# Altium schematic sheet RS_IF.SchDoc
size 420 x 297 mm; SheetNumber: 6; PageSetup: Record=PageOptions|CenterHorizontal=False|CenterVertical=False|PrintScale=0.95|XCorrection=0.00|YCorrection=0.00|PrintKind=1|BorderSize=5000000|LeftOffset=0|BottomOffset=0|Orientation=1|PaperLength=1000|PaperWidth=1000|Scale=100|PaperSource=15|PrintQuality=600|MediaType=1|DitherType=10|PaperKind=A4|PrintScaleMode=1
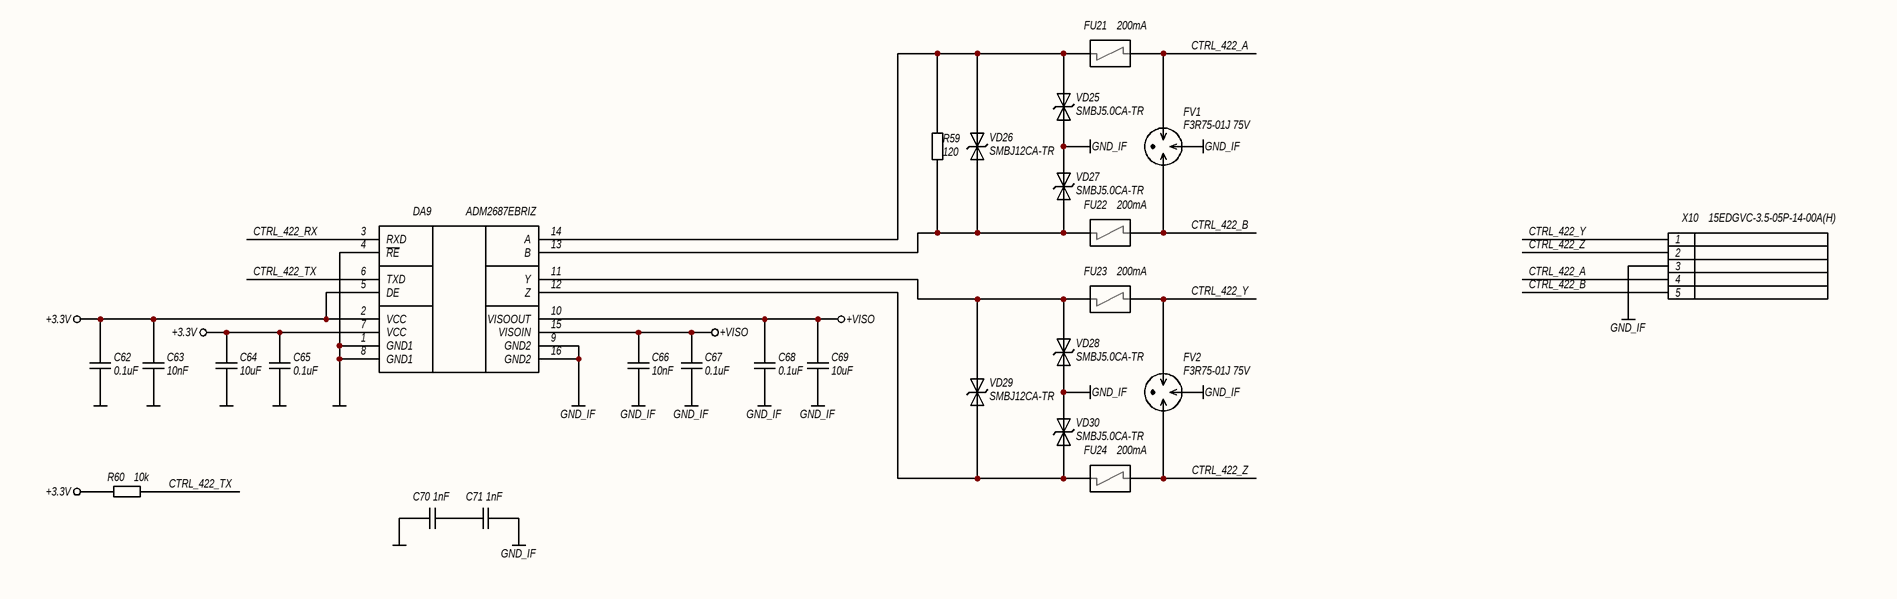
[diagram p0: RS_IF.SchDoc]

## Parts
C62  0.1uF  [C0603N]
C63  10nF  [C0603N]
C64  10uF  [C0805N]
C65  0.1uF  [C0603N]
C66  10nF  [C0603N]
C67  0.1uF  [C0603N]
C68  0.1uF  [C0603N]
C69  10uF  [C0805N]
C70  1nF  [C1808N]
C71  1nF  [C1808N]
DA9  ADM2687EBRIZ  [SOIC16_IC]
FU21  200mA  [TBU-CA]
FU22  200mA  [TBU-CA]
FU23  200mA  [TBU-CA]
FU24  200mA  [TBU-CA]
FV1  F3R75-01J 75V  [GDT_3PIN_B2]
FV2  F3R75-01J 75V  [GDT_3PIN_B2]
R59  120  [R0805N]
R60  10k  [R0603N]
VD25  SMBJ5.0CA-TR  [SMB]
VD26  SMBJ12CA-TR  [SMB]
VD27  SMBJ5.0CA-TR  [SMB]
VD28  SMBJ5.0CA-TR  [SMB]
VD29  SMBJ12CA-TR  [SMB]
VD30  SMBJ5.0CA-TR  [SMB]
X10  15EDGVC-3.5-05P-14-00A(H)  [15EDGVC-3.5-05P-14-00A(H)]

## Nets
+3.3V: C62.2 C63.1 C64.2 C65.2 DA9.2(VCC) DA9.5(DE) DA9.7(VCC) R60.2
+VISO: C66.1 C67.2 C68.2 C69.2 DA9.10(VISOOUT) DA9.15(VISOIN)
GND: C62.1 C63.2 C64.1 C65.1 C70.2 DA9.1(GND1) DA9.4(~{RE}) DA9.8(GND1)
GND_IF: C66.2 C67.1 C68.1 C69.1 C71.1 DA9.9(GND2) DA9.16(GND2) FV1.2 FV2.2 VD25.2(A2) VD27.2(A2) VD28.2(A2) VD30.2(A2) X10.3
CTRL_422_A: FU21.3(IN/OUT) FV1.1 X10.4
CTRL_422_B: FU22.3(IN/OUT) FV1.3 X10.5
CTRL_422_RX: DA9.3(RXD)
CTRL_422_TX: DA9.6(TXD) R60.1
CTRL_422_Y: FU23.3(IN/OUT) FV2.1 X10.1
CTRL_422_Z: FU24.3(IN/OUT) FV2.3 X10.2
NetC70_1: C70.1 C71.2
NetDA9_11: DA9.11(Y) FU23.1(IN/OUT) VD28.1(A1) VD29.1(A1)
NetDA9_12: DA9.12(Z) FU24.1(IN/OUT) VD29.2(A2) VD30.1(A1)
NetDA9_13: DA9.13(B) FU22.1(IN/OUT) R59.2 VD26.2(A2) VD27.1(A1)
NetDA9_14: DA9.14(A) FU21.1(IN/OUT) R59.1 VD25.1(A1) VD26.1(A1)

## Notes on the sheet
- Подп. и дата
- Инв. № дубл.
- Взам. инв. №
- Инв. № подл.
- Лист
- Изм.
- № докум.
- Подп.
- Дата
- Копировал
- Формат А3

## Library data of the parts
C62 C65 C67 C68 = CL10B104KB8NNNC: Конденсатор; Точность: 10%; Напряжение: 50V; Диэлектрик: X7R; Производитель: Samsung Electro-Mechanics; Описание: 0.1 µF ±10% 50V Ceramic Capacitor X7R 0603 (1608 Metric); Корпус: 0603 (1608 Metric); Температурный диапазон: -55°C ~ 125°C; Вид монтажа: SMD; Артикул: CL10B104KB8NNNC; Номинал: 0.1uF; Строка для документации: https://mm.digikey.com/Volume0/opasdata/d220001/medias/docus/609/CL10B104KB8NNNC_Spec.pdf; Тип элемента: Конденсатор
C63 C66 = CL10B103KB8NNNC: Конденсатор; Точность: 10%; Напряжение: 16V; Диэлектрик: X7R; Производитель: Samsung Electro-Mechanics; Описание: 10000 pF ±10% 50V Ceramic Capacitor X7R 0603 (1608 Metric); Корпус: 0603 (1608 Metric); Температурный диапазон: -55°C ~ 125°C; Вид монтажа: SMD; Артикул: CL10B103KB8NNNC; Номинал: 10nF; Строка для документации: https://mm.digikey.com/Volume0/opasdata/d220001/medias/docus/609/CL10B103KB8NNNC_Spec.pdf; Тип элемента: Конденсатор
C64 C69 = CL21A106KAYNNNE: Конденсатор; Точность: 10%; Напряжение: 25V; Диэлектрик: X5R; Производитель: Samsung Electro-Mechanics; Описание: 10 µF ±10% 25V Ceramic Capacitor X5R 0805 (2012 Metric); Корпус: 0805 (2012 Metric); Температурный диапазон: -55°C ~ 85°C; Вид монтажа: SMD; Артикул: CL21A106KAYNNNE; Номинал: 10uF; Строка для документации: https://mm.digikey.com/Volume0/opasdata/d220001/medias/docus/5545/CL21A106KAYNNNE%20Spec.pdf; Тип элемента: Конденсатор
C70 C71 = GA342DR7GF102KW02L: Конденсатор; Точность: 10%; Напряжение: 250VAC; Диэлектрик: X7R; Производитель: Murata Electronics; Описание: 1000 pF ±10% 250VAC Ceramic Capacitor X7R 1808 (4520 Metric); Корпус: 1808 (4520 Metric); Температурный диапазон: -55°C ~ 125°C; Вид монтажа: SMD; Артикул: GA342DR7GF102KW02L; Номинал: 1nF; Строка для документации: https://search.murata.co.jp/Ceramy/image/img/A01X/G101/ENG/GA342DR7GF102KW02-01.pdf; Тип элемента: Конденсатор
DA9 = ADM2687EBRIZ: Микросхема интерфейса RS485; Производитель: Analog Devices Inc.; Описание: RS422, RS485 Digital Isolator 5000Vrms 3 Channel 500kbps 25kV/µs CMTI 16-SOIC (0.295", 7.50mm Width); Корпус: 16-SOIC (0.295", 7.50mm Width); Температурный диапазон: -40°C ~ 85°C; Вид монтажа: SMD; Артикул: ADM2687EBRIZ; Строка для документации: https://www.analog.com/media/en/technical-documentation/data-sheets/ADM2682E_2687E.pdf; Тип элемента: Микросхема
FU21-FU24 = TBU-CA065-200-WH: Полупроводниковый предохранитель; Напряжение: 650V; Тип: Surge Suppression IС; Производитель: Bourns Inc.; Описание: SURGE SUPP TBU 200MA 650VIMP SMD; Корпус: 6.50mm x 4.00mm; Температурный диапазон: -55°C ~ 125°C; Вид монтажа: SMD; Артикул: TBU-CA065-200-WH; Ток: 200mA; Строка для документации: https://www.bourns.com/docs/Product-Datasheets/TBU-CA.pdf; Тип элемента: Предохранитель
FV1 FV2 = F3R75-01J 75V: Газовый разрядник, трехвыводный; Ток: 10kA; Тип: Gas Discharge Tube Arresters (GDT); Производитель: ZF; Описание: Gas Discharge Tube 75 V 10000A (10kA) ±25% 3 Pole Through Hole Mount; Корпус: 11.5mm x 7.5mm dia.; Вид монтажа: Through hole; Артикул: F3R75-01J 75V; Напряжение пробоя: 75V; Строка для документации: http://nbruitian.com/show.asp?id=1412; Тип элемента: Газовый разрядник
R59 = RC0805FR-07120RL: Резистор; Точность: 1%; ТКС: ±100ppm/°C; Напряжение: 150V; Производитель: YAGEO; Описание: 120 Ohms ±1% 0.125W, 1/8W Chip Resistor 0805 (2012 Metric) Moisture Resistant Thick Film; Корпус: 0805 (2012 Metric); Температурный диапазон: -55°C ~ 155°C; Вид монтажа: SMD; Артикул: RC0805FR-07120RL; Номинал: 120; Строка для документации: https://www.yageo.com/upload/media/product/productsearch/datasheet/rchip/PYu-RC_Group_51_RoHS_L_12.pdf; Тип элемента: Резистор
R60 = RC0603FR-0710KL: Резистор; Точность: 1%; ТКС: ±100ppm/°C; Напряжение: 75V; Производитель: YAGEO; Описание: 10 kOhms ±1% 0.1W, 1/10W Chip Resistor 0603 (1608 Metric) Moisture Resistant Thick Film; Корпус: 0603 (1608 Metric); Температурный диапазон: -55°C ~ 155°C; Вид монтажа: SMD; Артикул: RC0603FR-0710KL; Номинал: 10k; Строка для документации: https://www.yageo.com/upload/media/product/app/datasheet/rchip/pyu-rc_group_51_rohs_l.pdf; Тип элемента: Резистор
VD25 VD27 VD28 VD30 = SMBJ5.0CA-TR: TVS диод двунаправленный; Напряжение: 5V; Напряжение ограничения: 9.2V; Напряжение пробоя: 6.4V; Ток: 68A; Тип: TVS Bidirectional; Производитель: STMicroelectronics; Описание: 9.2V Clamp 68A Ipp Tvs Diode Surface Mount SMB (DO-214AA); Корпус: DO-214AA, SMB; Температурный диапазон: -55°C ~ 150°C (TJ); Вид монтажа: SMD; Тип элемента: Диод защитный; Артикул: SMBJ5.0CA-TR; Строка для документации: https://www.st.com/content/ccc/resource/technical/document/datasheet/19/78/91/39/07/cd/40/65/CD00001366.pdf/files/CD00001366.pdf/_jcr_content/translations/en.CD00001366.pdf
VD26 VD29 = SMBJ12CA-TR: TVS диод двунаправленный; Напряжение: 12V; Напряжение ограничения: 19.9V; Напряжение пробоя: 13.3V; Ток: 31A; Тип: TVS Bidirectional; Производитель: STMicroelectronics; Описание: 19.9V Clamp 31A Ipp Tvs Diode Surface Mount SMB (DO-214AA); Корпус: DO-214AA, SMB; Температурный диапазон: -55°C ~ 150°C (TJ); Вид монтажа: SMD; Тип элемента: Диод защитный; Артикул: SMBJ12CA-TR; Строка для документации: https://www.st.com/content/ccc/resource/technical/document/datasheet/19/78/91/39/07/cd/40/65/CD00001366.pdf/files/CD00001366.pdf/_jcr_content/translations/en.CD00001366.pdf
X10 = 15EDGVC-3.5-05P-14-00A(H): Разъем, 5 контактов; Тип разъема: Pluggable terminal block; Количество контактов: 5; Шаг контактов: 3.5mm; Ток: 7A; Напряжение: 250V; Производитель: Degson Electronics; Описание: Pluggable terminal block; 3.5mm; ways: 5; straight; socket; male; Температурный диапазон: -40°C ~ 105°C; Вид монтажа: Through Hole; Артикул: 15EDGVC-3.5-05P-14-00A(H); Строка для документации: https://www.tme.eu/Document/83e7173fe653a2d0e44585e87978945b/opr014R8.pdf; Тип элемента: Разъем